# EasyEDA schematic LcsNodes-Diagnostic-Board-B.00.01.json
TITLE: Sheet_1; REV: 1.0; Date: 2024-02-12; Sheet: 1/1; Drawn By: helmut-f; Company: Your Company
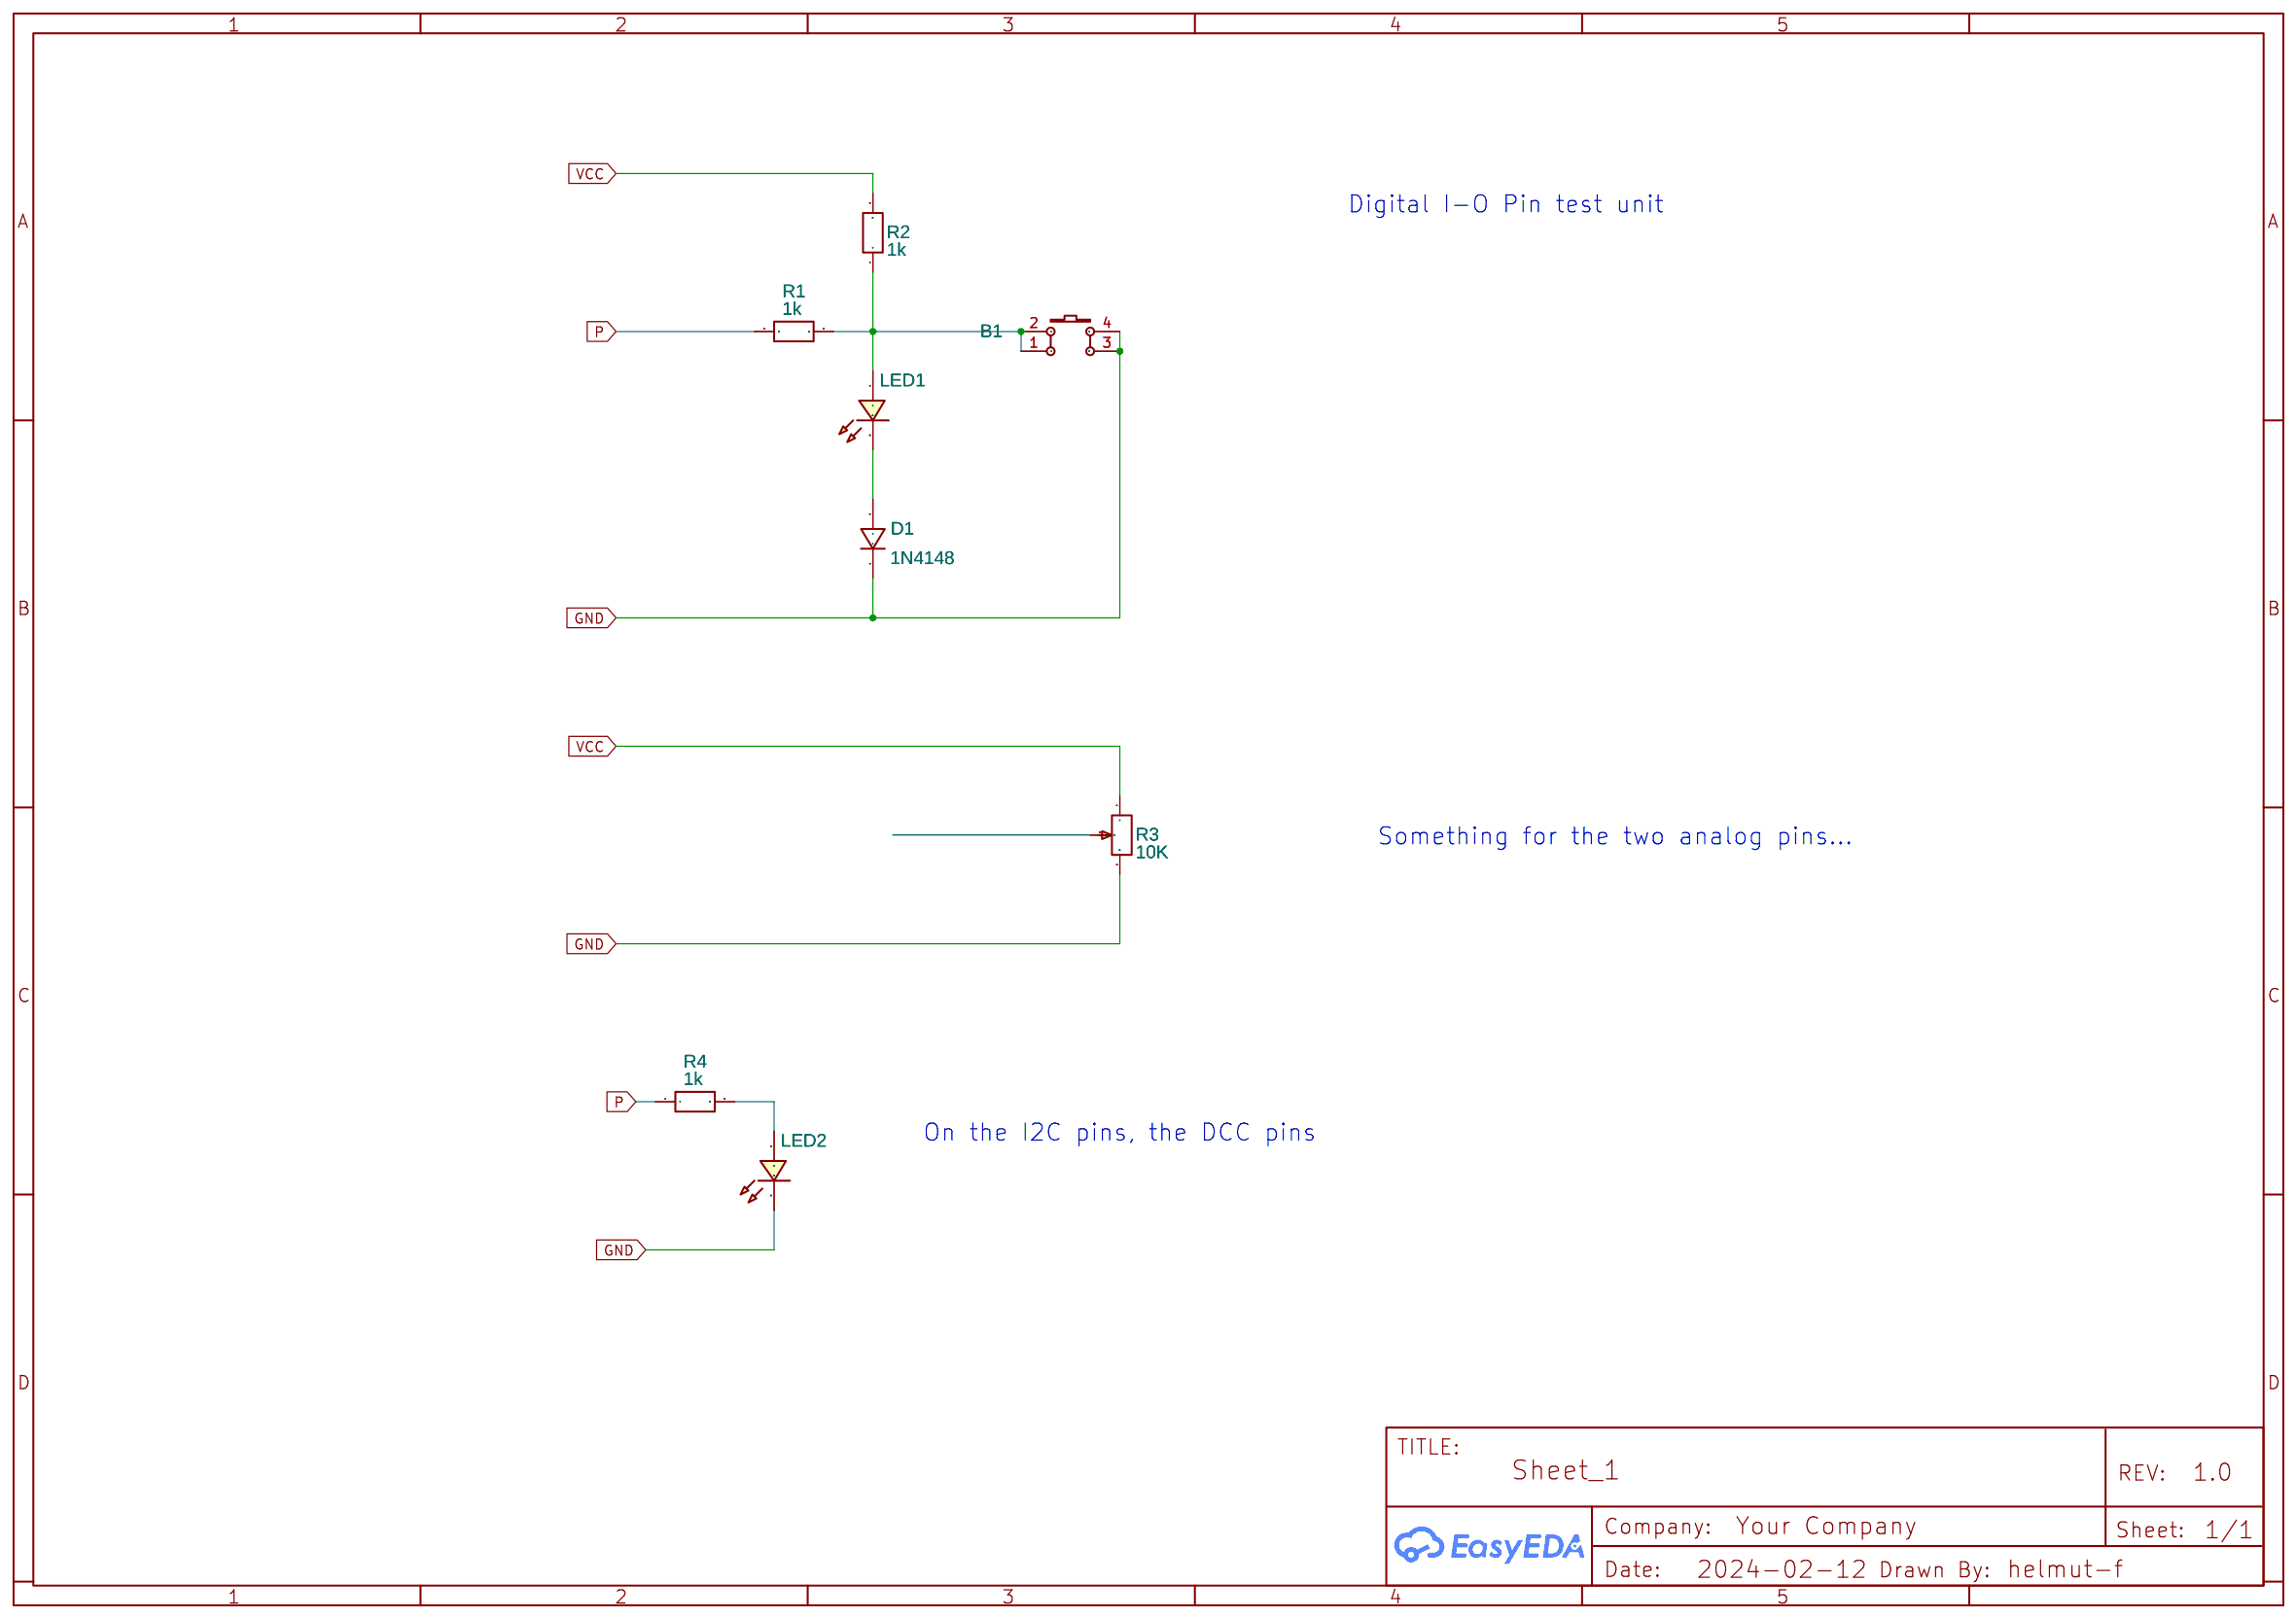
[diagram p0: schematic sheet]

## Parts
B1  Opt  [SW-SMD_4P-L6.0-W6.0-P4.50-LS9.0_C23873]
D1  1N4148  [SOD-80C_L3.3-W1.5-RD]
LED1  LED-0603_R  [LED-1206]
LED2  LED-0603_R  [LED-1206]
R1  1k  [R1206]
R2  1k  [R1206]
R3  10K  [RES-ADJ-TH_3296W]
R4  1k  [R1206]

## Library data of the parts
B1 = K4-6×6_TH: Supplier: LCSC; Supplier Part: C136684; Manufacturer: 韩国韩荣; Manufacturer Part: K2-1102DP-E4SW-04; Contributor: LCEDA_Lib; Package Display: No
D1 = 1N4148: Supplier: LCSC; Manufacturer: SEMTECH; Supplier Part: C14516; Contributor: LCEDA_Lib
LED1 LED2 = LED-0603_R: Manufacturer: EVERLIGHT(台湾亿光); Manufacturer Part: 19-217/R6C-AL1M2VY/3T; Supplier Part: C72044; Supplier: LCSC; Contributor: LCEDA_01
R1 R2 R4 = R_1206_EU: Contributor: LCEDA_Lib
R3 = Precision potentiometer 3296W/50ohm: Supplier Part: C21881; Supplier: LCSC; Manufacturer: ReliaPro; JLCPCB Part Class: Extended Part

## Nets
GND: B1.3 B1.4 D1.1(2) LED2.2 R3.3
VCC: R2.2 R3.1
P: R1.1 R4.1
Net-(B1-1): B1.1 B1.2 LED1.1 R1.2 R2.1
Net-(D1-2): D1.2(1) LED1.2
Net-(LED2-1): LED2.1 R4.2

Not connected (* = marked no-connect by the designer): R3 2

## Notes on the sheet
- Digital I-O Pin test unit
- Something for the two analog pins...
- On the I2C pins, the DCC pins
